# Altium project LCL_015 ESP8266SerialProgrammer.PrjPcb
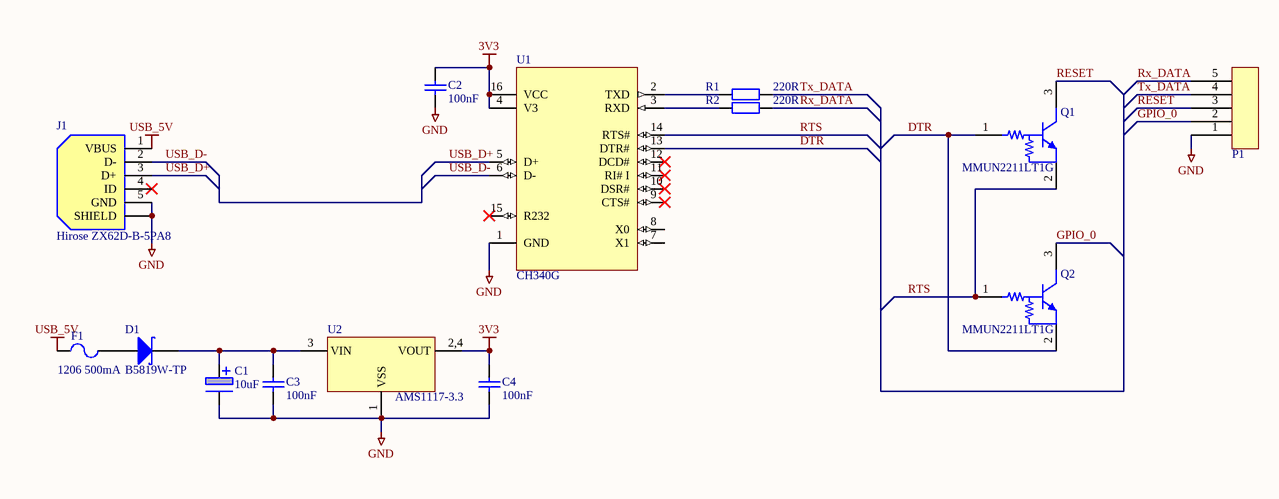
[diagram p0: LCL_015 ESP8266 Serial Programmer.SchDoc]
1 sheet, 14 parts. Net scope: global (net labels, ports and power ports of the same name join across sheets).
Board file: LCL_015 ESP8266 Serial Programmer.PcbDoc

## Sheet LCL_015 ESP8266 Serial Programmer.SchDoc: TITLE
size A4; Address1: ludzinc.blogspot.com.au; Address3: www.lowcostlabs.com.au; DocumentNumber: LCL_xxx; Revision: V1.00; SheetNumber: 1; SheetTotal: 1

### Parts
C1  10uF  [PCB-ekxurobr9mz5kbw5d2ks-1]
C2  100nF  [PCB-xz5e0ntg24ede4ywr789-1]
C3  100nF  [PCB-xz5e0ntg24ede4ywr789-1]
C4  100nF  [PCB-xz5e0ntg24ede4ywr789-1]
D1  B5819W-TP  [SOD-123_B]
F1  1206 500mA  [PCB-3gxvn3dwrwfh67y4w0ib-1]
J1  Hirose ZX62D-B-5PA8  [HIRO-ZX62D-B]
P1  Ninigi ZL263-5SG  [PCB-0utnuxhvegbjdpyxogng-1]  (value not drawn)
Q1  MMUN2211LT1G  [ONSC-SOT-23-3-318-08_V]
Q2  MMUN2211LT1G  [ONSC-SOT-23-3-318-08_V]
R1  220R  [PCB-nyzt47j077kuntqddeld-1]
R2  220R  [PCB-nyzt47j077kuntqddeld-1]
U1  CH340G  [M16A_L]
U2  AMS1117-3.3  [AMS1117-SOT223]

### Nets
3V3: C2.2 C4.2 U1.4(V3) U1.16(VCC) U2.2,4(VOUT)
GND: C1.2 C2.1 C3.1 C4.1 J1.5(GND) J1.SHIELD P1.1 U1.1(GND) U2.1(VSS)
USB_5V: F1.1 J1.1(VBUS)
DTR: Q1.1(B) Q2.2(E) U1.13(DTR#)
GPIO_0: P1.2 Q2.3(C)
RESET: P1.3 Q1.3(C)
RTS: Q1.2(E) Q2.1(B) U1.14(RTS#)
Rx_DATA: P1.5 R2.2
Tx_DATA: P1.4 R1.2
USB_D+: J1.3(D+) U1.5(D+)
USB_D-: J1.2(D-) U1.6(D-)
NetC1_1: C1.1 C3.2 D1.1(K) U2.3(VIN)
NetD1_2: D1.2(A) F1.2
NetR1_1: R1.1 U1.2(TXD)
NetR2_1: R2.1 U1.3(RXD)

Not connected (* = marked no-connect by the designer): J1 4(ID)*; U1 7(X1) 8(X0) 9(CTS#)* 10(DSR#)* 11(RI#_I)* 12(DCD#)* 15(R232)*

### Notes on the sheet
- LOW COST LABS
- Title
- Size:
- Date:
- A4
- Number:
- Revision:
- Sheet
- of
- File:

### Library data of the parts
C1 = CMP-su2zmkw1kc3z49ns9isd-1: 5mm Through Hole Electrolytic 2mm Pitch, 5mm height; CustomComponentID: su2zmkw1kc3z49ns9isd
C2-C4 = 0603 CAPACITOR-1: GENERIC 0603 CAPACITOR (IPCC COMPLIANT); CustomComponentID: xz5e0ntg24ede4ywr789
D1 = CMP-6f92a7ef8d3eb055-1: Diode Schottky 20v 1a Sod123; OctopartID: 6f92a7ef8d3eb055; Manufacturer Part Number: B5819W-TP; Seller Landing  Url: https://octopart-clicks.com/click/track?c=1&country=US&ak=8157f166&sig=0b3e5d3&sid=459&ppid=24627146&vpid=61929901&ct=offers; Octopart Url: http://octopart.com/b5819w-tp-mcc-24627146
F1 = CMP-4gkvc5d32zhwfvpctic1-2: Polyswitch 1206 500mA; CustomComponentID: 4gkvc5d32zhwfvpctic1
J1 = CMP-284de3f198a7f78a-3: HIROSE; Gender: Female; Lead-Free Status: Lead Free; Number of Contacts: 5; REACH SVHC Compliance: No SVHC; Seller Landing  Url: https://octopart-clicks.com/click/track?country=US&ak=8157f166&sig=0730679&sid=2402&ppid=45520268&vpid=118253616&ct=offers; Manufacturer Part Number: ZX62D-B-5PA8; Contact Material: Copper; Contact Plating: Gold; RoHS: Compliant; Octopart Url: http://octopart.com/zx62d-b-5pa8-hirose-45520268; OctopartID: 284de3f198a7f78a; Orientation: Right Angle; Packaging: Cut Tape (CT); Mounting Style: Through Hole
P1 = CMP-272feff3989ff8e8-1: Socket; pin strips; female; PIN: 5; angled 90°; 2.54mm; THT; 1x5; Octopart URL: http://octopart.com/zl263-5sg-ninigi-30841558; Manufacturer Part Number: ZL263-5SG; Orientation: Right Angle; Contact Plating: Gold; OctopartID: 272feff3989ff8e8
Q1 Q2 = CMP-866803-1: Digital Transistor (BRT), R1=10 kOhm, R2=10 kOhm, NPN Transistor, 3-Pin SOT-23, Pb-Free, Tape and Reel; SVHC: No SVHC (19-Dec-2012); Transistor Type: Bias Resistor (BRT); Power Dissipation Pd: 246mW; Collector Emitter Voltage Vces: -250mV; Pin Configuration: 1; Voltage Vcbo: 50V; No. of Pins: 3; Current Ic hFE: 5mA; DC Collector Current: 100mA; DC Current Gain hFE: 60; SMD Marking: A8A; Power Dissipation Ptot Max: 200mW; CiivaID: 866803; Hfe Min: 35; Resistance R1: 10kohm; Transistor Case Style: SOT-23; Transistor Polarity: NPN; Collector Emitter Voltage V(br)ceo: 50V; Ciiva URL: https://ciiva.com/part/MMUN2211LT1G-866803; Package / Case: SOT-23; No. of Transistors: 1; Resistance R2: 10kohm
R1 R2 = CMP-nyzt47j077kuntqddeld-3: GENERIC 0603 RESISTOR (IPCC COMPLIANT); CustomComponentID: nyzt47j077kuntqddeld
U1 = CMP-69cda32a7c8ab60a-2: CH340G USB To Serial (TTL) Module; 317990026-ND: 317990026; Manufacturer Part Number: CH340G; OctopartID: 69cda32a7c8ab60a
U2 = CMP-3fd1f74ee88ee016-8: Sot223/Pkg 1-Amp 3.3-Volt Low Drop Out Voltage Regulatator